# Altium schematic sheet Power Supply.SchDoc
size A; DrawnBy: Nick D'Ademo; DocumentNumber: 11; Revision: A; SheetNumber: 11; SheetTotal: 11
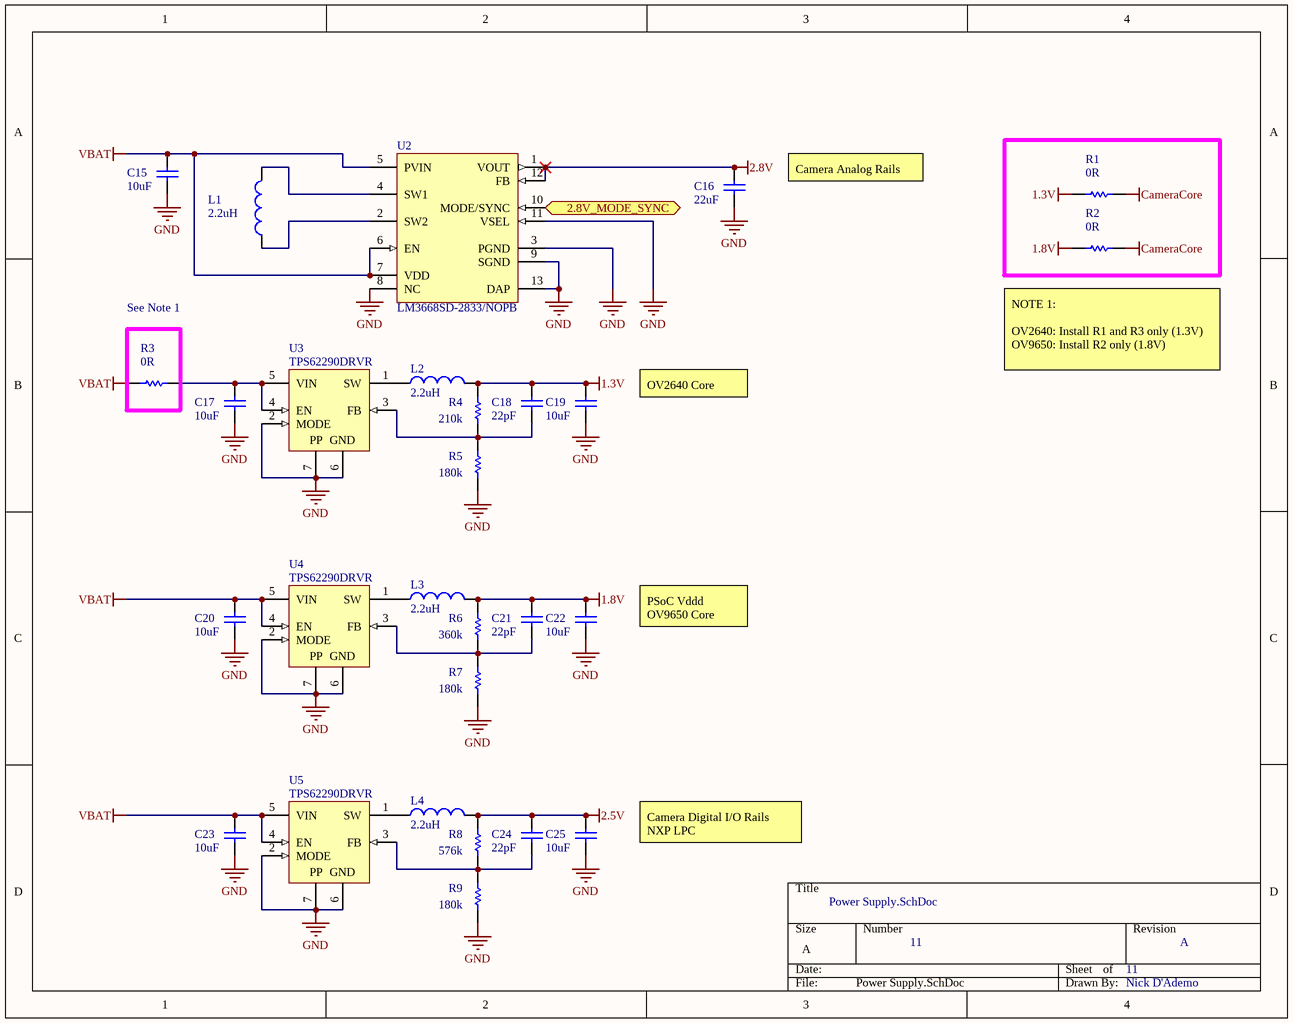
[diagram p0: Power Supply.SchDoc]

## Parts
C15  value 10uF  [CAPC2012N]  (hidden comment: Cap)
C16  value 22uF  [CAPC2012N]  (hidden comment: Cap)
C17  value 10uF  [CAPC2012N]  (hidden comment: Cap)
C18  value 22pF  [CAPC1005N]  (hidden comment: Cap)
C19  value 10uF  [CAPC2012N]  (hidden comment: Cap)
C20  value 10uF  [CAPC2012N]  (hidden comment: Cap)
C21  value 22pF  [CAPC1005N]  (hidden comment: Cap)
C22  value 10uF  [CAPC2012N]  (hidden comment: Cap)
C23  value 10uF  [CAPC2012N]  (hidden comment: Cap)
C24  value 22pF  [CAPC1005N]  (hidden comment: Cap)
C25  value 10uF  [CAPC2012N]  (hidden comment: Cap)
L1  value 2.2uH  [COILCRAFT_LPS4018]  (hidden comment: Inductor)
L2  value 2.2uH  [COILCRAFT_LPS4018]  (hidden comment: Inductor)
L3  value 2.2uH  [COILCRAFT_LPS4018]  (hidden comment: Inductor)
L4  value 2.2uH  [COILCRAFT_LPS4018]  (hidden comment: Inductor)
R1  value 0R  [RESC1608N]  (hidden comment: Res1)
R2  value 0R  [RESC1608N]  (hidden comment: Res1)
R3  value 0R  [RESC1608N]  (hidden comment: Res1)
R4  value 210k  [RESC1608N]  (hidden comment: Res1)
R5  value 180k  [RESC1608N]  (hidden comment: Res1)
R6  value 360k  [RESC1608N]  (hidden comment: Res1)
R7  value 180k  [RESC1608N]  (hidden comment: Res1)
R8  value 576k  [RESC1608N]  (hidden comment: Res1)
R9  value 180k  [RESC1608N]  (hidden comment: Res1)
U2  LM3668SD-2833/NOPB  [SDF12A]
U3  TPS62290DRVR  [DRV6-1600X1000TP]
U4  TPS62290DRVR  [DRV6-1600X1000TP]
U5  TPS62290DRVR  [DRV6-1600X1000TP]

## Blocks framed on the sheet
See Note 1: R3

## Ports
2.8V_MODE_SYNC

## Nets
1.3V: C18.2 C19.2 L2.2 R1.2 R4.2
1.8V: C21.2 C22.2 L3.2 R2.2 R6.2
2.5V: C24.2 C25.2 L4.2 R8.2
2.8V: C16.2 U2.1(VOUT) U2.12(FB)
CameraCore: R1.1 R2.1
GND: C15.1 C16.1 C17.1 C19.1 C20.1 C22.1 C23.1 C25.1 R5.1 R7.1 R9.1 U2.3(PGND) U2.8(NC) U2.9(SGND) U2.11(VSEL) U2.13(DAP) U3.2(MODE) U3.6(GND) U3.7(PP) U4.2(MODE) U4.6(GND) U4.7(PP) U5.2(MODE) U5.6(GND) U5.7(PP)
VBAT: C15.2 C20.2 C23.2 R3.2 U2.5(PVIN) U2.6(EN) U2.7(VDD) U4.4(EN) U4.5(VIN) U5.4(EN) U5.5(VIN)
2.8V_MODE_SYNC: U2.10(MODE/SYNC) ; port 2.8V_MODE_SYNC
NetC17_2: C17.2 R3.1 U3.4(EN) U3.5(VIN)
NetC18_1: C18.1 R4.1 R5.2 U3.3(FB)
NetC21_1: C21.1 R6.1 R7.2 U4.3(FB)
NetC24_1: C24.1 R8.1 R9.2 U5.3(FB)
NetL1_1: L1.1 U2.2(SW2)
NetL1_2: L1.2 U2.4(SW1)
NetL2_1: L2.1 U3.1(SW)
NetL3_1: L3.1 U4.1(SW)
NetL4_1: L4.1 U5.1(SW)

## Notes on the sheet
- Camera Analog Rails
- (near R2) NOTE 1:
  OV2640: Install R1 and R3 only (1.3V)
  OV9650: Install R2 only (1.8V)
- OV2640 Core
- PSoC Vddd
  OV9650 Core
- Camera Digital I/O Rails
  NXP LPC

## Library data of the parts
C15 C17 C19 C20 C22 C23 C25 = Cap: TAIYO YUDEN - LMK212 BJ106MG-T - CAP, MLCC, X5R, 10UF, 10V, 0805; Published: 8-Jun-2000; LatestRevisionDate: 17-Jul-2002; LatestRevisionNote: Re-released for DXP Platform.; PackageReference: RAD-0.3; Publisher: Altium Limited; PackageDescription: Radial Cap, Thru-Hole; 2 Leads; 0.3 in Pin Spacing
C16 = Cap: TAIYO YUDEN - LMK212BJ226MG-T - CAPACITOR CERAMIC 22UF, 10V, X5R, 0805; Published: 8-Jun-2000; LatestRevisionDate: 17-Jul-2002; LatestRevisionNote: Re-released for DXP Platform.; PackageReference: RAD-0.3; Publisher: Altium Limited; PackageDescription: Radial Cap, Thru-Hole; 2 Leads; 0.3 in Pin Spacing
C18 C21 C24 = Cap: Capacitor, NP0, ±5%, 25V, 0402; Published: 8-Jun-2000; LatestRevisionDate: 17-Jul-2002; LatestRevisionNote: Re-released for DXP Platform.; PackageReference: RAD-0.3; Publisher: Altium Limited; PackageDescription: Radial Cap, Thru-Hole; 2 Leads; 0.3 in Pin Spacing
L1-L4 = Inductor: COILCRAFT - LPS4018-222MRB - INDUCTOR, SHLD, 2.2UH, 20%, 1.5A, SMD; Code_IEC: 1005; Published: 8-Jun-2000; LatestRevisionDate: 29-May-2009; LatestRevisionNote: IPC-7351 Footprint Added.; PackageReference: 0402-A; Publisher: Altium Limited; PackageDescription: Chip Inductor; Code_JEITA: 0402
R1-R9 = Res1: Resistor, ±1%, 0.1W, 0603; Published: 8-Jun-2000; LatestRevisionDate: 17-Jul-2002; LatestRevisionNote: Re-released for DXP Platform.; PackageReference: AXIAL-0.3; Publisher: Altium Limited; PackageDescription: Axial Device, Thru-Hole; 2 Leads; 0.3 in Pin Spacing
U2 = LM3668SD-2833/NOPB: 1A, High Efficiency Dual Mode Single Inductor Buck-Boost DC/DC Converter, 12-pin LLP, Pb-Free; Manufacturer: National Semiconductor; PackageTopMarking: ZXYTT*S017B; PowerWise: Y; CompType: MiscPower; DatasheetVersion: Sep-2008; PackageVersion: revB, Jul-2008; PackageReference: SDF12A; PackageDescription: LLP, Plastic, Dual, 3 x 3 x 0.8mm Body, 12 Lead, 0.4mm Pitch, No Pullback; PartNumber: LM3668SD-2833/NOPB; RoHS: Y; PinCount: 12; High-Reliability: Y; ComponentLink1Description: Manufacturer URL; ComponentLink1URL: http://www.national.com/; ComponentLink2Description: LM3668 Datasheet; ComponentLink2URL: http://www.national.com/ds/LM/LM3668.pdf; ComponentLink3Description: LM3668 Web Page; ComponentLink3URL: http://www.national.com/pf/LM/LM3668.html; ComponentLink4Description: SDF12A Package Page; ComponentLink4URL: http://www.national.com/packaging/folders/sdf12a.html
U3-U5 = TPS62290DRVR: Buck Step Down Regulator with 2.3 to 6 V Input and 0.6 to 6 V Output, -40 to 85 degC, 6-Pin SON (DRV), Green (RoHS & no Sb/Br); Manufacturer: Texas Instruments; Duty Cycle(Max)(%): 100; Iout(Max)(A): 1; Iq(Typ)(mA): 0.015; Rating: Catalog; SubFamily: Step-Down Regulator; Switch Current Limit(Typ)(A): 1.4; Synchronous Rectification: TRUE; Vin(Max)(V): 6; Vin(Min)(V): 2.3; Vout(Min)(V): 0.6; DatasheetVersion: SLVS764C; PackageVersion: revE, Oct-2010; PackageReference: DRV6-1600X1000TP; PackageDescription: 6-Pin Plastic Small Outline No-Lead, 2 x 2 x 0.8 mm Body, 0.65 mm Pitch, Exposed Pad; Supplier 1: Digi-Key; Supplier Part Number 1: 296-27030-2-ND; Supplier 2: Digi-Key; Supplier Part Number 2: 296-27030-1-ND; Supplier 3: Digi-Key; Supplier Part Number 3: 296-27030-6-ND; Supplier 4: Newark; Supplier Part Number 4: 50M9135; Supplier 5: Mouser; Supplier Part Number 5: 595-TPS62290DRVR; Eco-Plan: Green (RoHS & no Sb/Br); Regulated Outputs(#): 1; Topology: Buck; Vout(Max)(V): 6; Mounting Technology: Surface Mount; PartNumber: TPS62290DRVR; ComponentLink1Description: Datasheet; ComponentLink1URL: http://www.ti.com/general/docs/lit/getliterature.tsp?genericPartNumber=TPS62290&fileType=pdf; ComponentLink2Description: Package Specification; ComponentLink2URL: http://www.ti.com/litv/pdf/mpds216d; ComponentLink3Description: URL Link1; ComponentLink3URL: Samples URL:http://www.ti.com/product/tps62290#samples